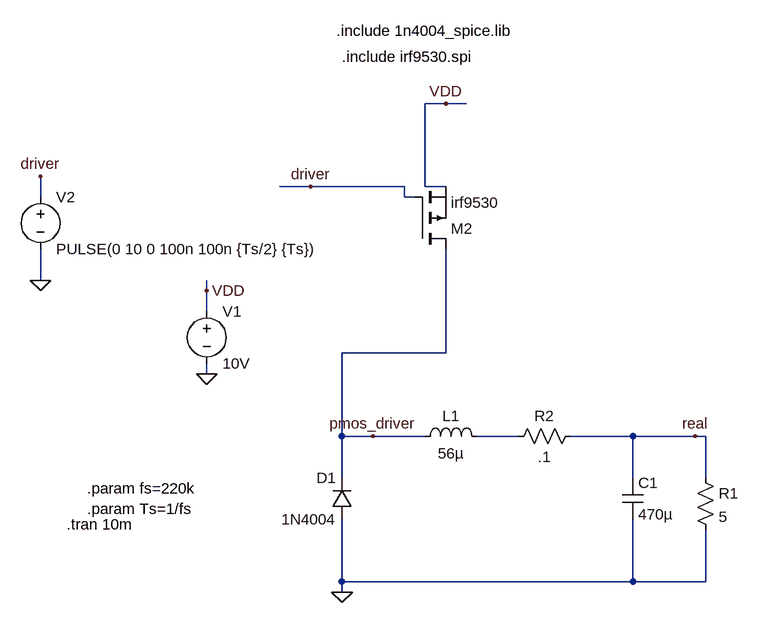
[diagram p0: schematic schem_reality.asc]
schem_reality.asc, the LTspice schematic file:
Version 4.1
SHEET 1 904 1092
WIRE 448 -208 416 -208
WIRE 480 -208 448 -208
WIRE 240 -80 192 -80
WIRE 384 -80 240 -80
WIRE 416 -80 416 -208
WIRE 448 -80 416 -80
WIRE -176 -64 -176 -96
WIRE 384 -64 384 -80
WIRE 400 -64 384 -64
WIRE -176 64 -176 16
WIRE 80 80 80 64
WIRE 80 112 80 80
WIRE 448 176 448 16
WIRE 448 176 288 176
WIRE 80 208 80 192
WIRE 288 304 288 176
WIRE 336 304 288 304
WIRE 416 304 336 304
WIRE 560 304 496 304
WIRE 736 304 640 304
WIRE 832 304 736 304
WIRE 848 304 832 304
WIRE 288 368 288 304
WIRE 736 368 736 304
WIRE 848 368 848 304
WIRE 288 528 288 432
WIRE 736 528 736 432
WIRE 736 528 288 528
WIRE 848 528 848 448
WIRE 848 528 736 528
WIRE 288 544 288 528
FLAG 80 80 VDD
FLAG 448 -208 VDD
FLAG 288 544 0
FLAG 80 208 0
FLAG -176 64 0
FLAG -176 -96 driver
FLAG 240 -80 driver
FLAG 832 304 real
FLAG 336 304 pmos_driver
SYMBOL voltage 80 96 R0
WINDOW 123 0 0 Left 0
WINDOW 39 0 0 Left 0
SYMATTR InstName V1
SYMATTR Value 10V
SYMBOL ind 400 320 R270
WINDOW 0 32 56 VTop 2
WINDOW 3 5 56 VBottom 2
SYMATTR InstName L1
SYMATTR Value 56µ
SYMATTR SpiceLine Rser=0
SYMBOL cap 720 368 R0
SYMATTR InstName C1
SYMATTR Value 470µ
SYMBOL voltage -176 -80 R0
WINDOW 123 0 0 Left 0
WINDOW 39 0 0 Left 0
SYMATTR InstName V2
SYMATTR Value PULSE(0 10 0 100n 100n {Ts/2} {Ts})
SYMBOL res 832 352 R0
SYMATTR InstName R1
SYMATTR Value 5
SYMBOL pmos 400 16 M180
SYMATTR InstName M2
SYMATTR Value irf9530
SYMATTR Prefix X
SYMBOL diode 304 432 R180
WINDOW 0 24 64 Left 2
WINDOW 3 24 0 Left 2
SYMATTR InstName D1
SYMATTR Value 1N4004
SYMATTR Prefix X
SYMBOL res 656 288 R90
WINDOW 0 0 56 VBottom 2
WINDOW 3 32 56 VTop 2
SYMATTR InstName R2
SYMATTR Value .1
TEXT -104 416 Left 2 !.param Ts=1/fs
TEXT -104 384 Left 2 !.param fs=220k
TEXT -136 440 Left 2 !.tran 10m
TEXT 288 -280 Left 2 !.include irf9530.spi
TEXT 280 -320 Left 2 !.include 1n4004_spice.lib

The netlist it stands for:
* schem_reality.asc
V1 VDD 0 10V
L1 pmos_driver N001 56µ Rser=0
C1 real 0 470µ
V2 driver 0 PULSE(0 10 0 100n 100n {Ts/2} {Ts})
R1 real 0 5
X§M2 pmos_driver driver VDD irf9530  ; pins D G S
X§D1 0 pmos_driver 1N4004  ; pins + -
R2 real N001 .1
.param Ts=1/fs
.param fs=220k
.tran 10m
.include irf9530.spi
.include 1n4004_spice.lib
.backanno
.end